# Altium project Touch_Screen.PrjPcb
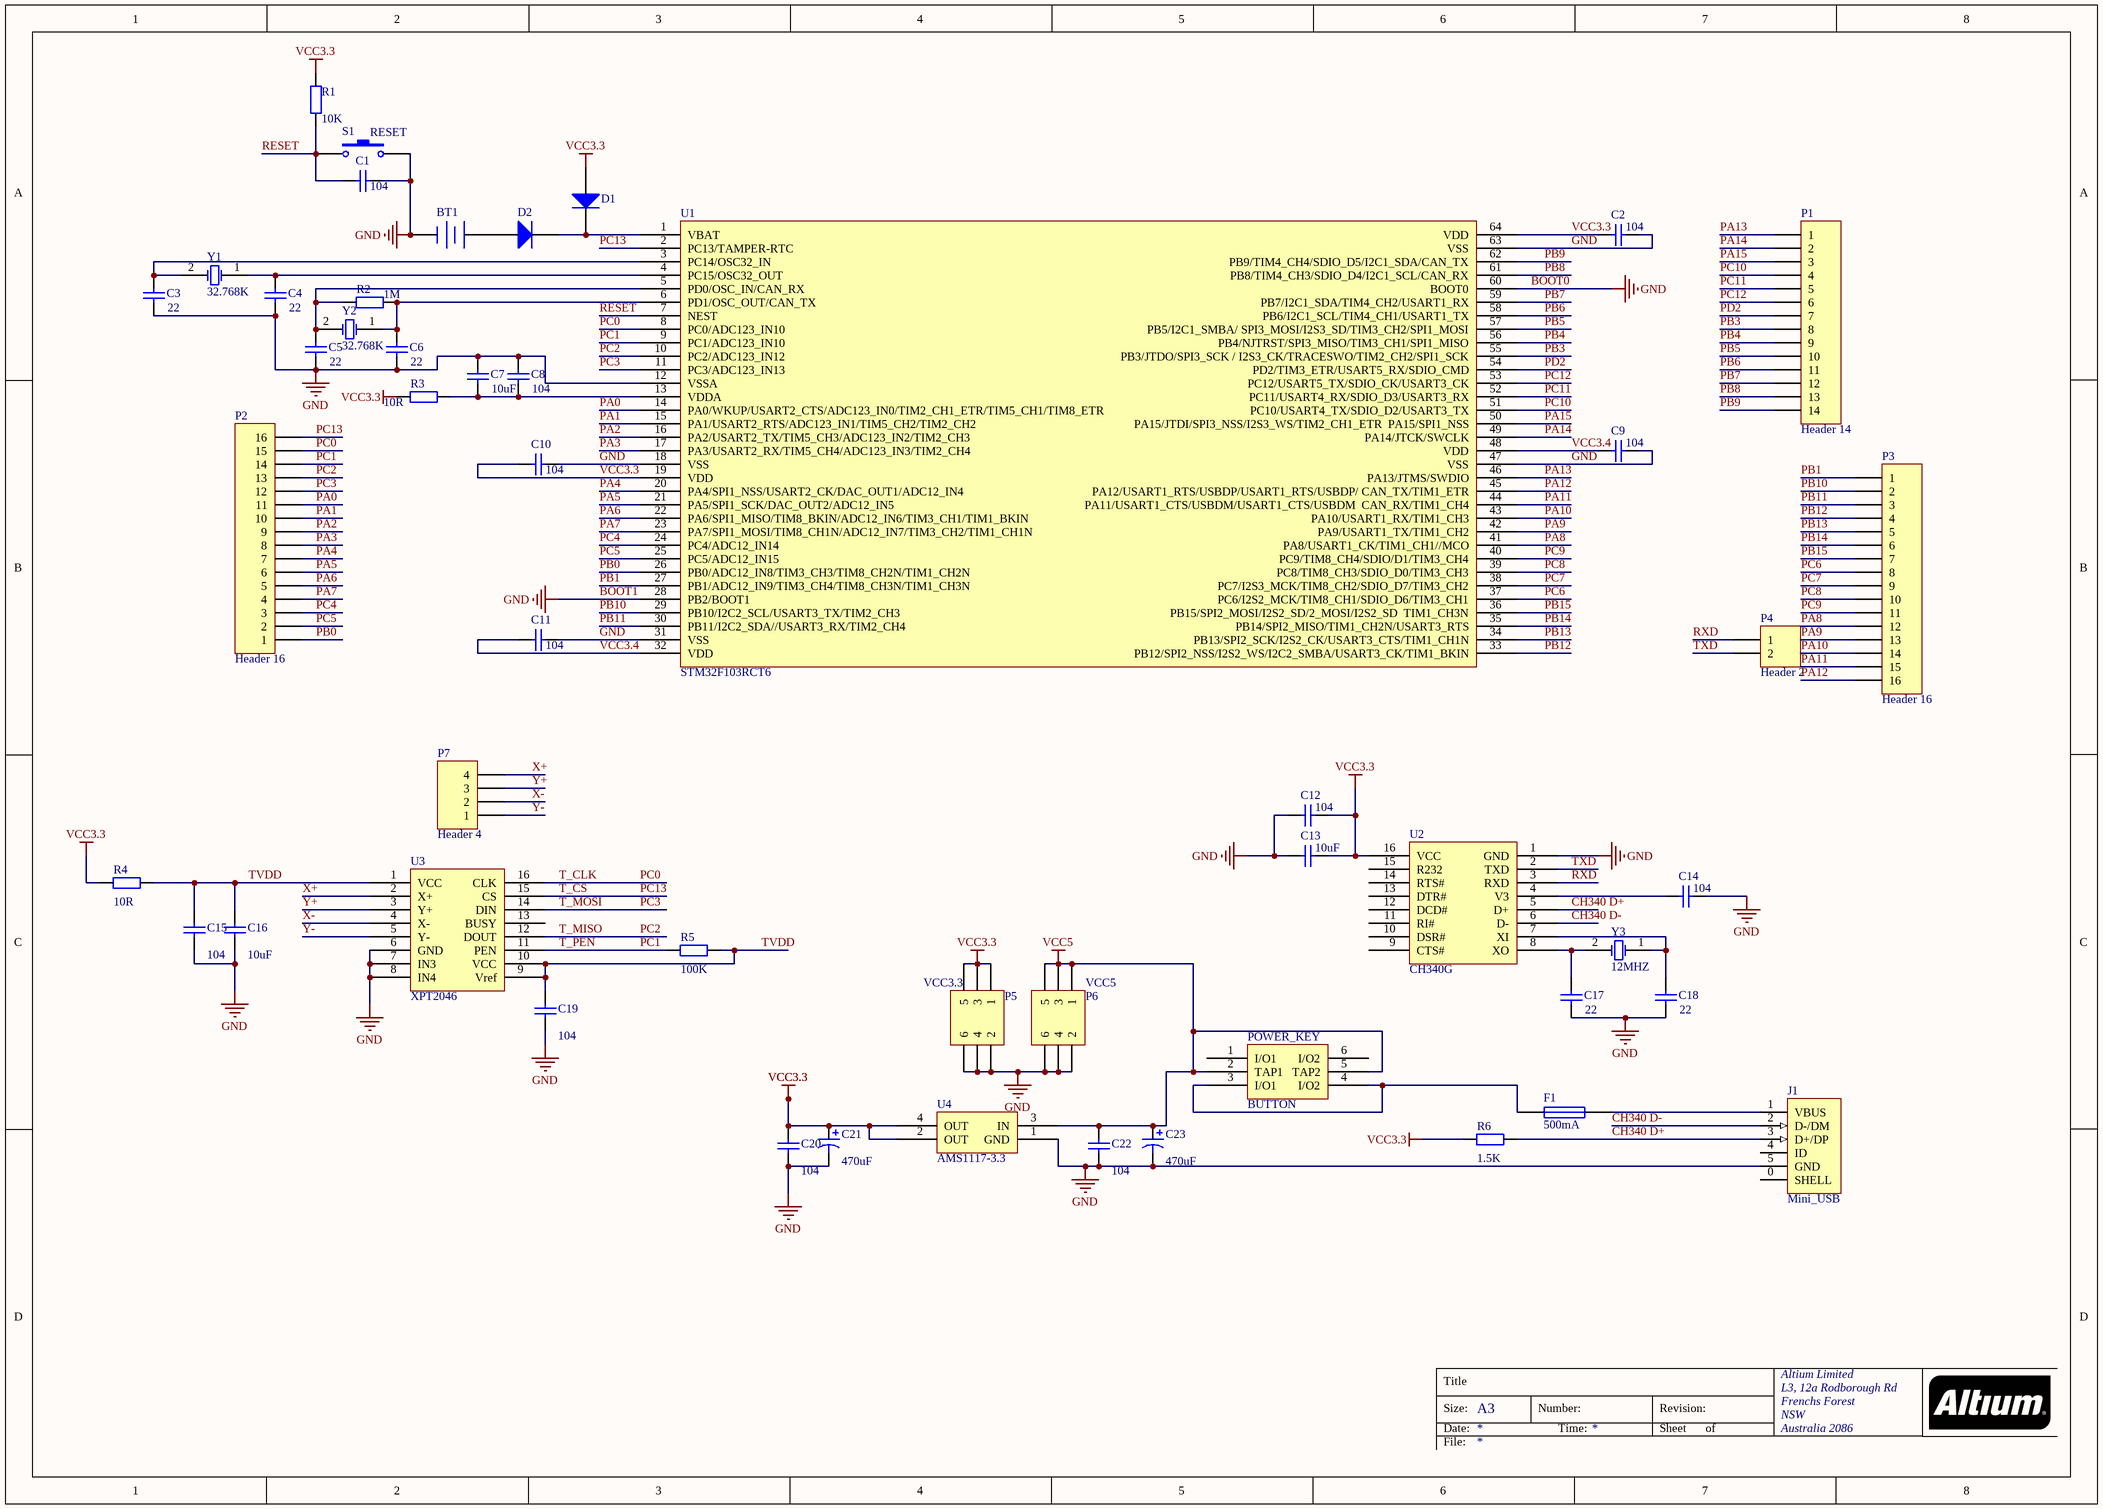
[diagram p0: miniSystrm.SchDoc]
1 sheet, 50 parts. Net scope: global (net labels, ports and power ports of the same name join across sheets).
Board file: Touch_Screen.PcbDoc

## Sheet miniSystrm.SchDoc
size A3; Organization: Altium Limited; Address1: L3, 12a Rodborough Rd; Address2: Frenchs Forest; Address3: NSW; Address4: Australia 2086

### Parts
BT1  (no value)  [BAT-2]
C1  value 104  [CAP-0603]
C2  value 104  [CAP-0603]
C3  value 22  [CAP-0603]
C4  value 22  [CAP-0603]
C5  value 22  [CAP-0603]
C6  value 22  [CAP-0603]
C7  value 10uF  [CAP-0603]
C8  value 104  [CAP-0603]
C9  value 104  [CAP-0603]
C10  value 104  [CAP-0603]
C11  value 104  [CAP-0603]
C12  value 104  [CAP-0603]
C13  value 10uF  [CAP-0603]
C14  value 104  [CAP-0603]
C15  value 104  [CAP-0603]
C16  value 10uF  [CAP-0603]
C17  value 22  [CAP-0603]
C18  value 22  [CAP-0603]
C19  value 104  [CAP-0603]
C20  value 104  [CAP-0603]
C21  value 470uF  [CAP-7343]
C22  value 104  [CAP-0603]
C23  value 470uF  [CAP-7343]
D1  (no value)  [DIODE-SMA]
D2  (no value)  [DIODE-SMA]
F1  500mA  [PIN-W2/E2.8]
J1  Mini_USB  [miniUSB]
P1  Header 14  [HDR1X14]
P2  Header 16  [HDR1X16]
P3  Header 16  [HDR1X16]
P4  Header 2  [HDR1X2]
P5  VCC3.3  [HDR2X3]
P6  VCC5  [HDR2X3]
P7  Header 4  [HDR1X4]
POWER_KEY  BUTTON  [六脚自锁开关]
R1  value 10K  [RES-0603]
R2  value 1M  [RES-0603]
R3  value 10R  [RES-0603]
R4  value 10R  [RES-0603]
R5  value 100K  [RES-0603]
R6  value 1.5K  [RES-0603]
S1  RESET  [SPST-2]
U1  STM32F103RCT6  [LQFP-64]
U2  CH340G  [SOP16]
U3  XPT2046  [TSSOP-16]
U4  AMS1117-3.3  [SOT223]
Y1  32.768K  [R38]
Y2  32.768K  [R38]
Y3  12MHZ  [R38]

### Nets
BOOT0: BT1.2(-) C1.1 C2.1 C3.1 C4.1 C5.1 C6.1 C7.1 C8.2 C9.1 C10.1 C11.1 C12.2 C13.2 C14.1 C15.2 C16.2 C17.1 C18.1 C19.2 C20.2 C21.2 C22.2 C23.2 J1.5(GND) P5.2 P5.4 P5.6 P6.2 P6.4 P6.6 S1.2 U1.12(VSSA) U1.18(VSS) U1.28(PB2/BOOT1) U1.31(VSS) U1.47(VSS) U1.60(BOOT0) U1.63(VSS) U2.1(GND) U3.6(GND) U3.7(IN3) U3.8(IN4) U4.1(GND)  [also labelled BOOT1, GND]
VCC3.3: C2.2 C10.2 C12.1 C13.1 C20.1 C21.1 D1.1(A) P5.1 P5.3 P5.5 R1.2 R3.2 R4.2 R6.2 U1.19(VDD) U1.64(VDD) U2.16(VCC) U4.2(OUT) U4.4(OUT)
VCC5: C22.1 C23.1 P6.1 P6.3 P6.5 POWER_KEY.2(TAP1) POWER_KEY.5(TAP2) U4.3(IN)
CH340 D+: J1.3(D+/DP) R6.1 U2.5(D+)
CH340 D-: J1.2(D-/DM) U2.6(D-)
PA0: P2.11 U1.14(PA0/WKUP/USART2_CTS/ADC123_IN0/TIM2_CH1_ETR/TIM5_CH1/TIM8_ETR)
PA1: P2.10 U1.15(PA1/USART2_RTS/ADC123_IN1/TIM5_CH2/TIM2_CH2)
PA2: P2.9 U1.16(PA2/USART2_TX/TIM5_CH3/ADC123_IN2/TIM2_CH3)
PA3: P2.8 U1.17(PA3/USART2_RX/TIM5_CH4/ADC123_IN3/TIM2_CH4)
PA4: P2.7 U1.20(PA4/SPI1_NSS/USART2_CK/DAC_OUT1/ADC12_IN4)
PA5: P2.6 U1.21(PA5/SPI1_SCK/DAC_OUT2/ADC12_IN5)
PA6: P2.5 U1.22(PA6/SPI1_MISO/TIM8_BKIN/ADC12_IN6/TIM3_CH1/TIM1_BKIN)
PA7: P2.4 U1.23(PA7/SPI1_MOSI/TIM8_CH1N/ADC12_IN7/TIM3_CH2/TIM1_CH1N)
PA8: P3.12 U1.41(PA8/USART1_CK/TIM1_CH1//MCO)
PA9: P3.13 U1.42(PA9/USART1_TX/TIM1_CH2)
PA10: P3.14 U1.43(PA10/USART1_RX/TIM1_CH3)
PA11: P3.15 U1.44(PA11/USART1_CTS/USBDM/USART1_CTS/USBDM__CAN_RX/TIM1_CH4)
PA12: P3.16 U1.45(PA12/USART1_RTS/USBDP/USART1_RTS/USBDP/_CAN_TX/TIM1_ETR)
PA13: P1.1 U1.46(PA13/JTMS/SWDIO)
PA14: P1.2 U1.49(PA14/JTCK/SWCLK)
PA15: P1.3 U1.50(PA15/JTDI/SPI3_NSS/I2S3_WS/TIM2_CH1_ETR__PA15/SPI1_NSS)
PB0: P2.1 U1.26(PB0/ADC12_IN8/TIM3_CH3/TIM8_CH2N/TIM1_CH2N)
PB1: P3.1 U1.27(PB1/ADC12_IN9/TIM3_CH4/TIM8_CH3N/TIM1_CH3N)
PB3: P1.8 U1.55(PB3/JTDO/SPI3_SCK_/_I2S3_CK/TRACESWO/TIM2_CH2/SPI1_SCK)
PB4: P1.9 U1.56(PB4/NJTRST/SPI3_MISO/TIM3_CH1/SPI1_MISO)
PB5: P1.10 U1.57(PB5/I2C1_SMBA/_SPI3_MOSI/I2S3_SD/TIM3_CH2/SPI1_MOSI)
PB6: P1.11 U1.58(PB6/I2C1_SCL/TIM4_CH1/USART1_TX)
PB7: P1.12 U1.59(PB7/I2C1_SDA/TIM4_CH2/USART1_RX)
PB8: P1.13 U1.61(PB8/TIM4_CH3/SDIO_D4/I2C1_SCL/CAN_RX)
PB9: P1.14 U1.62(PB9/TIM4_CH4/SDIO_D5/I2C1_SDA/CAN_TX)
PB10: P3.2 U1.29(PB10/I2C2_SCL/USART3_TX/TIM2_CH3)
PB11: P3.3 U1.30(PB11/I2C2_SDA//USART3_RX/TIM2_CH4)
PB12: P3.4 U1.33(PB12/SPI2_NSS/I2S2_WS/I2C2_SMBA/USART3_CK/TIM1_BKIN)
PB13: P3.5 U1.34(PB13/SPI2_SCK/I2S2_CK/USART3_CTS/TIM1_CH1N)
PB14: P3.6 U1.35(PB14/SPI2_MISO/TIM1_CH2N/USART3_RTS)
PB15: P3.7 U1.36(PB15/SPI2_MOSI/I2S2_SD/2_MOSI/I2S2_SD__TIM1_CH3N)
PC0: P2.15 U1.8(PC0/ADC123_IN10) U3.16(CLK)  [also labelled T_CLK]
PC1: P2.14 R5.2 U1.9(PC1/ADC123_IN10) U3.11(PEN)  [also labelled T_PEN]
PC2: P2.13 U1.10(PC2/ADC123_IN12) U3.12(DOUT)  [also labelled T_MISO]
PC3: P2.12 U1.11(PC3/ADC123_IN13) U3.14(DIN)  [also labelled T_MOSI]
PC4: P2.3 U1.24(PC4/ADC12_IN14)
PC5: P2.2 U1.25(PC5/ADC12_IN15)
PC6: P3.8 U1.37(PC6/I2S2_MCK/TIM8_CH1/SDIO_D6/TIM3_CH1)
PC7: P3.9 U1.38(PC7/I2S3_MCK/TIM8_CH2/SDIO_D7/TIM3_CH2)
PC8: P3.10 U1.39(PC8/TIM8_CH3/SDIO_D0/TIM3_CH3)
PC9: P3.11 U1.40(PC9/TIM8_CH4/SDIO/D1/TIM3_CH4)
PC10: P1.4 U1.51(PC10/USART4_TX/SDIO_D2/USART3_TX)
PC11: P1.5 U1.52(PC11/USART4_RX/SDIO_D3/USART3_RX)
PC12: P1.6 U1.53(PC12/USART5_TX/SDIO_CK/USART3_CK)
PC13: P2.16 U1.2(PC13/TAMPER-RTC) U3.15(CS)  [also labelled T_CS]
PD2: P1.7 U1.54(PD2/TIM3_ETR/USART5_RX/SDIO_CMD)
RESET: C1.2 R1.1 S1.1 U1.7(NEST)
RXD: P4.1 U2.3(RXD)
TVDD: C15.1 C16.1 C19.1 R4.1 R5.1 U3.1(VCC) U3.9(Vref) U3.10(VCC)
TXD: P4.2 U2.2(TXD)
VCC3.4: C9.2 C11.2 U1.32(VDD) U1.48(VDD)
X+: P7.4 U3.2(X+)
X-: P7.2 U3.4(X-)
Y+: P7.3 U3.3(Y+)
Y-: P7.1 U3.5(Y-)
NetBT1_1: BT1.1(+) D2.1(A)
NetC3_2: C3.2 U1.3(PC14/OSC32_IN) Y1.2(OSC2)
NetC4_2: C4.2 U1.4(PC15/OSC32_OUT) Y1.1(OSC1)
NetC5_2: C5.2 R2.1 U1.5(PD0/OSC_IN/CAN_RX) Y2.2(OSC2)
NetC6_2: C6.2 R2.2 U1.6(PD1/OSC_OUT/CAN_TX) Y2.1(OSC1)
NetC7_2: C7.2 C8.1 R3.1 U1.13(VDDA)
NetC14_2: C14.2 U2.4(V3)
NetC17_2: C17.2 U2.8(XO) Y3.2(OSC2)
NetC18_2: C18.2 U2.7(XI) Y3.1(OSC1)
NetD1_2: D1.2(K) D2.2(K) U1.1(VBAT)
NetF1_1: F1.1 POWER_KEY.3(I/O1) POWER_KEY.4(I/O2)
NetF1_2: F1.2 J1.1(VBUS)

Not connected (* = marked no-connect by the designer): J1 0(SHELL) 4(ID); POWER_KEY 1(I/O1) 6(I/O2); U2 9(CTS#) 10(DSR#) 11(RI#) 12(DCD#) 13(DTR#) 14(RTS#) 15(R232); U3 13(BUSY)

### Notes on the sheet
- Title
- Size:
- Date:
- File:
- A3
- Number:
- Time:
- Revision:
- Sheet
- of

### Library data of the parts
BT1 = Battery: Multicell Battery; Published: 24-Mar-1999; LatestRevisionDate: 17-Jul-2002; LatestRevisionNote: Re-released for DXP Platform.; PackageReference: BAT-2; Publisher: Altium Limited; PackageDescription: Battery; 2 Leads
C1-C20 C22 = Cap: Capacitor; Published: 8-Jun-2000; LatestRevisionDate: 17-Jul-2002; LatestRevisionNote: Re-released for DXP Platform.; PackageReference: RAD-0.3; Publisher: Altium Limited; PackageDescription: Radial Cap, Thru-Hole; 2 Leads; 0.3 in Pin Spacing
C21 C23 = Cap Pol1: Polarized Capacitor (Radial); Published: 8-Jun-2000; LatestRevisionDate: 17-Jul-2002; LatestRevisionNote: Re-released for DXP Platform.; PackageReference: RB7.6-15; Publisher: Altium Limited; PackageDescription: Polarized Capacitor (Radial); 2 Leads
D1 D2 = Diode 1N4001: 1 Amp General Purpose Rectifier; Published: 8-Jun-2000; LatestRevisionDate: 17-Jul-2002; LatestRevisionNote: Re-released for DXP Platform.; DatasheetVersion: 1998; PackageVersion: Aug-1999; PackageReference: DO-41; Publisher: Altium Limited; PackageDescription: Diode, Axial; Body 5.2 x 2.7 mm (LxDia. max), Lead Dia. 0.86 mm (max); Code_JEDEC: DO-204-AL; ComponentLink1Description: Manufacturer Link; ComponentLink1URL: http://www.fairchildsemi.com/; ComponentLink2Description: Datasheet; ComponentLink2URL: http://www.fairchildsemi.com/ds/1N%2F1N4001.pdf
F1 = Fuse 1: Fuse; Published: 8-Jun-2000; LatestRevisionDate: 17-Jul-2002; LatestRevisionNote: Re-released for DXP Platform.; PackageReference: PIN-W2/E2.8; Publisher: Altium Limited; PackageDescription: Thru-Hole; 2 Leads
J1 = Mini_USB: USB 2.0, Right Angle, SMT, B Type, Receptacle, 5 Position, Black; ContactMaterial: Copper Alloy; ContactPlating: Gold (30); PCB_Layout: Complies with manufacturer's recommendation.; DrillSize: Corresponds to nominal value.; PanelGround: Without; Published: 15-Jul-2004; DatasheetDocument: 27-Jun-2003; PackageDocument: 27-Jun-2003; PackageReference: 440247; Publisher: Altium Limited; HousingMaterial: Thermoplastic; ComponentLink1Description: Manufacturer Link; ComponentLink1URL: http://www.tycoelectronics.com/; ComponentLink2Description: Packaging Specification; ComponentLink2URL: http://ecommas.tycoelectronics.com/commerce/DocumentDelivery/DDEController?Action=showdoc&DocId=Customer+Drawing%7F440247%7FD%7Fpdf%7FEnglish%7FC_440247_D.pdf
P1 = Header 14: Header, 14-Pin; LatestRevisionDate: 17-Jul-2002; LatestRevisionNote: Re-released for DXP Platform.; Publisher: Altium Limited
P2 P3 = Header 16: Header, 16-Pin; LatestRevisionDate: 17-Jul-2002; LatestRevisionNote: Re-released for DXP Platform.; Publisher: Altium Limited
P4 = Header 2: Header, 2-Pin; LatestRevisionDate: 17-Jul-2002; LatestRevisionNote: Re-released for DXP Platform.; Publisher: Altium Limited
P5 P6 = Header 3X2: Header, 3-Pin, Dual row; LatestRevisionDate: 17-Jul-2002; LatestRevisionNote: Re-released for DXP Platform.; Publisher: Altium Limited
P7 = Header 4: Header, 4-Pin; LatestRevisionDate: 17-Jul-2002; LatestRevisionNote: Re-released for DXP Platform.; Publisher: Altium Limited
R1-R6 = Res2: Resistor; Published: 8-Jun-2000; LatestRevisionDate: 17-Jul-2002; LatestRevisionNote: Re-released for DXP Platform.; PackageReference: AXIAL-0.4; Publisher: Altium Limited; PackageDescription: Axial Device, Thru-Hole; 2 Leads; 0.4 in Pin Spacing
S1 = SW-PB: Switch; Published: 24-Mar-1999; LatestRevisionDate: 17-Jul-2002; LatestRevisionNote: Re-released for DXP Platform.; PackageReference: SPST-2; Publisher: Altium Limited; PackageDescription: Switch; 2 Leads
Y1-Y3 = XTAL: Crystal Oscillator; Published: 8-Jun-2000; LatestRevisionDate: 17-Jul-2002; LatestRevisionNote: Re-released for DXP Platform.; PackageReference: R38; Publisher: Altium Limited; PackageDescription: Crystal, Thru-Hole; 2 Leads; Body 3.1 x 8.2 mm (Dia.xH)